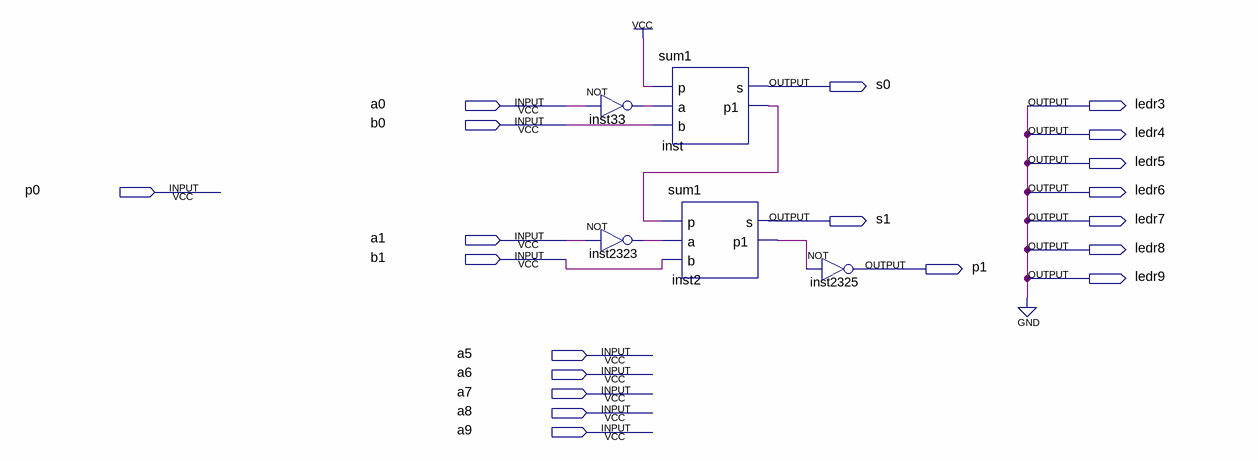
[diagram p0: schematic sheet]
// Quartus schematic main.bdf as structural Verilog: 5 symbols, 20 pins
module main (
  input  a0,
  input  b0,
  input  p0,
  input  a1,
  input  b1,
  input  a5,
  input  a6,
  input  a7,
  input  a8,
  input  a9,
  output s0,
  output ledr3,
  output ledr4,
  output ledr5,
  output ledr6,
  output s1,
  output ledr7,
  output ledr8,
  output p1,
  output ledr9
);

  wire inst2_p1, inst33_out, inst2323_out, inst_p1;

  sum1 inst (.p(1'b1), .a(inst33_out), .b(b0), .s(s0), .p1(inst_p1));
  not inst33 (inst33_out, a0);
  not inst2323 (inst2323_out, a1);
  sum1 inst2 (.p(inst_p1), .a(inst2323_out), .b(b1), .s(s1), .p1(inst2_p1));
  not inst2325 (p1, inst2_p1);

  assign ledr3 = 1'b0;
  assign ledr4 = 1'b0;
  assign ledr5 = 1'b0;
  assign ledr6 = 1'b0;
  assign ledr7 = 1'b0;
  assign ledr8 = 1'b0;
  assign ledr9 = 1'b0;
endmodule
